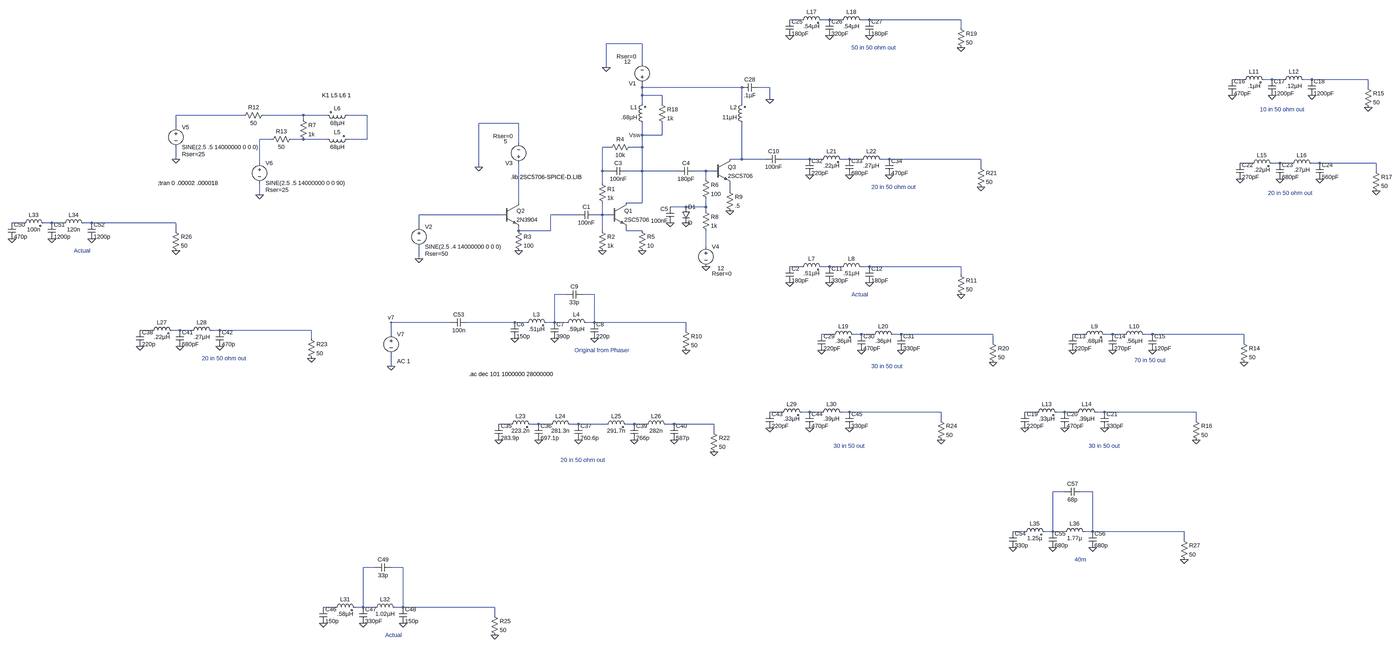
[diagram p0: schematic Phaser PA Impedance.asc, whole sheet]
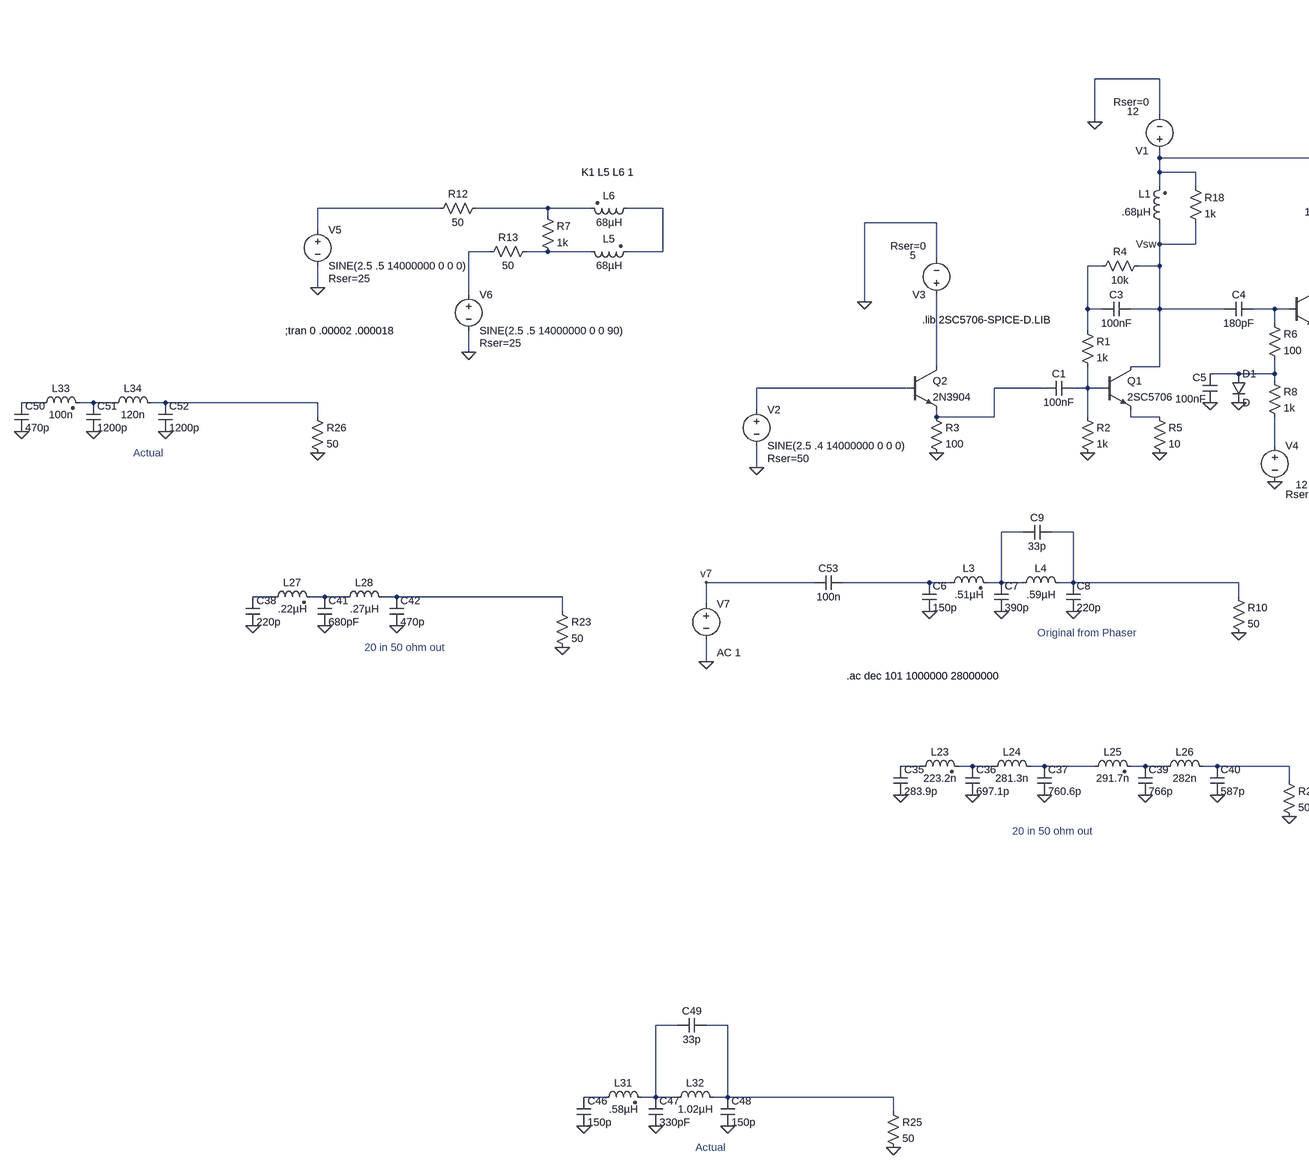
[diagram p1: schematic Phaser PA Impedance.asc, part, row 1 of 1, column 1 of 2]
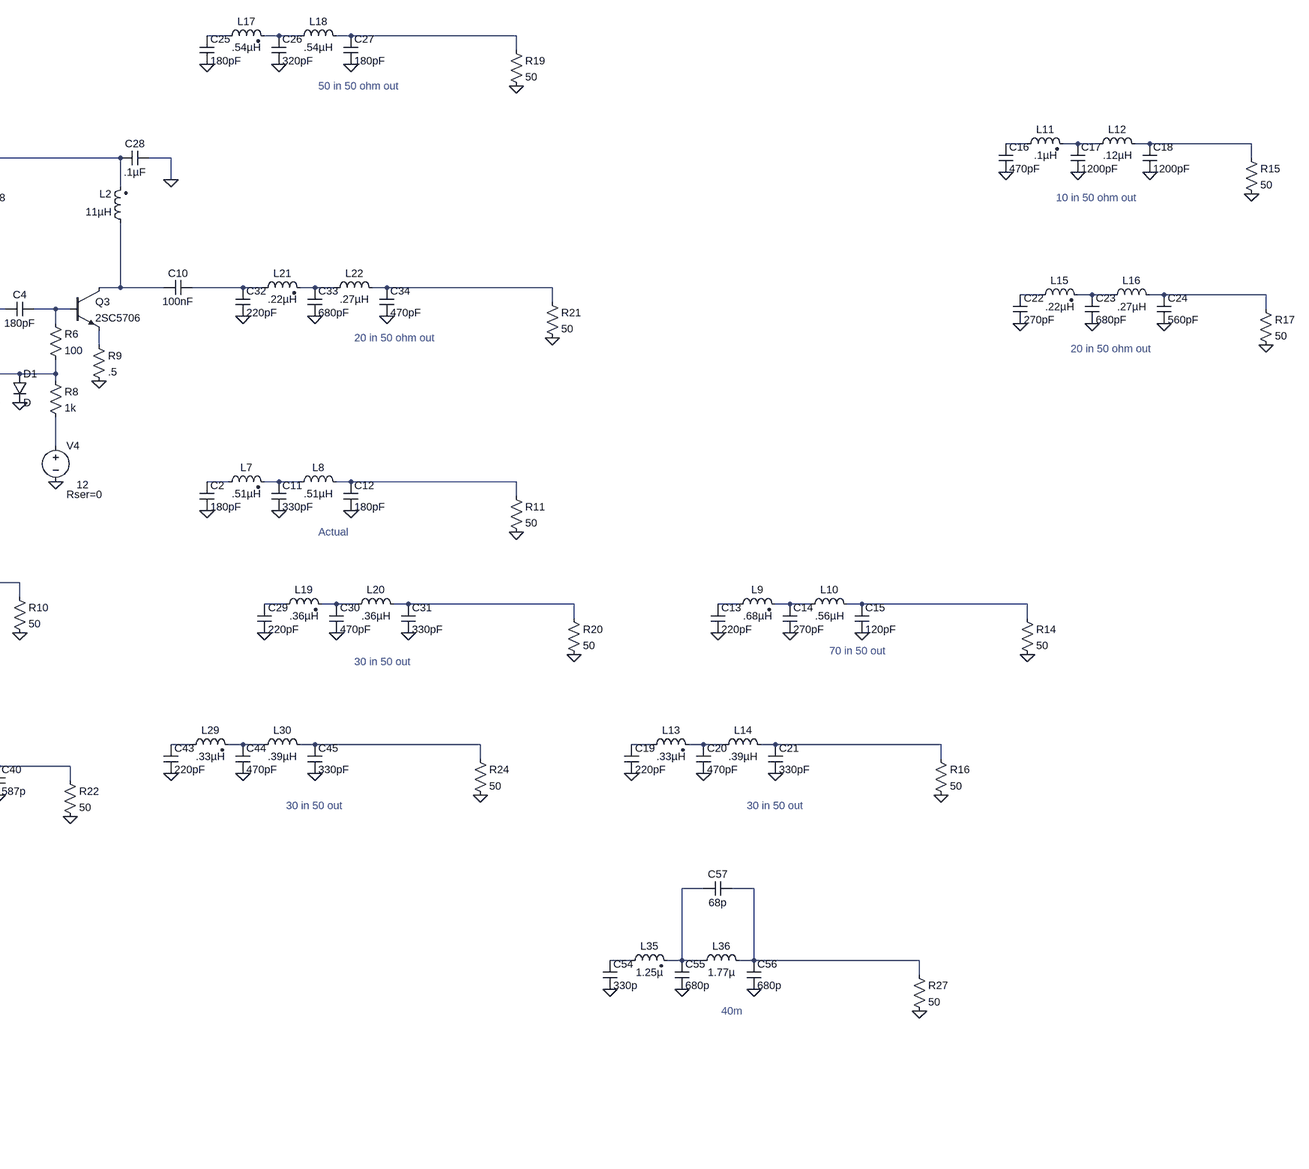
[diagram p2: schematic Phaser PA Impedance.asc, part, row 1 of 1, column 2 of 2]
Phaser PA Impedance.asc, the LTspice schematic file:
Version 4
SHEET 1 3764 2004
WIRE 1216 -560 1168 -560
WIRE 1328 -560 1296 -560
WIRE 1376 -560 1328 -560
WIRE 1488 -560 1456 -560
WIRE 1856 -560 1488 -560
WIRE 1856 -528 1856 -560
WIRE 576 -464 432 -464
WIRE 576 -384 576 -464
WIRE 432 -368 432 -464
WIRE 2992 -320 2944 -320
WIRE 3104 -320 3072 -320
WIRE 3152 -320 3104 -320
WIRE 3264 -320 3232 -320
WIRE 3632 -320 3264 -320
WIRE 576 -288 576 -304
WIRE 976 -288 576 -288
WIRE 1088 -288 1040 -288
WIRE 3632 -288 3632 -320
WIRE 576 -256 576 -288
WIRE 656 -256 576 -256
WIRE 1088 -240 1088 -288
WIRE 576 -224 576 -256
WIRE 656 -224 656 -256
WIRE 976 -224 976 -288
WIRE -1024 -176 -1296 -176
WIRE -784 -176 -944 -176
WIRE -688 -176 -784 -176
WIRE -528 -176 -608 -176
WIRE -784 -160 -784 -176
WIRE 80 -144 -80 -144
WIRE -1296 -128 -1296 -176
WIRE 576 -96 576 -144
WIRE 656 -96 656 -144
WIRE 656 -96 576 -96
WIRE -912 -80 -960 -80
WIRE -784 -80 -832 -80
WIRE -688 -80 -784 -80
WIRE -528 -80 -528 -176
WIRE -528 -80 -608 -80
WIRE 80 -64 80 -144
WIRE 448 -48 416 -48
WIRE 576 -48 576 -96
WIRE 576 -48 528 -48
WIRE -1296 0 -1296 -48
WIRE 976 0 976 -144
WIRE 976 0 928 0
WIRE 1072 0 976 0
WIRE 1248 0 1136 0
WIRE 1296 0 1248 0
WIRE 1408 0 1376 0
WIRE 1456 0 1408 0
WIRE 1568 0 1536 0
WIRE 1936 0 1568 0
WIRE -960 16 -960 -80
WIRE 3024 16 2976 16
WIRE 3136 16 3104 16
WIRE 3184 16 3136 16
WIRE 3296 16 3264 16
WIRE 3664 16 3296 16
WIRE -80 32 -80 -144
WIRE 1936 32 1936 0
WIRE 416 48 416 -48
WIRE 448 48 416 48
WIRE 576 48 576 -48
WIRE 576 48 512 48
WIRE 720 48 576 48
WIRE 832 48 784 48
WIRE 864 48 832 48
WIRE 3664 48 3664 16
WIRE 832 80 832 48
WIRE 416 96 416 48
WIRE 928 128 928 96
WIRE -960 144 -960 96
WIRE 80 176 80 16
WIRE 576 176 576 48
WIRE 576 176 512 176
WIRE 752 192 688 192
WIRE 832 192 832 160
WIRE 832 192 752 192
WIRE 832 208 832 192
WIRE 16 224 -320 224
WIRE 320 224 208 224
WIRE 416 224 416 176
WIRE 416 224 384 224
WIRE 448 224 416 224
WIRE -1936 256 -1984 256
WIRE -1824 256 -1856 256
WIRE -1776 256 -1824 256
WIRE -1664 256 -1696 256
WIRE -1296 256 -1664 256
WIRE -320 272 -320 224
WIRE -1296 288 -1296 256
WIRE 80 288 80 272
WIRE 208 288 208 224
WIRE 208 288 80 288
WIRE 416 288 416 224
WIRE 512 288 512 272
WIRE 576 288 512 288
WIRE 832 352 832 288
WIRE -320 400 -320 352
WIRE 1216 432 1168 432
WIRE 1328 432 1296 432
WIRE 1376 432 1328 432
WIRE 1488 432 1456 432
WIRE 1856 432 1488 432
WIRE 1856 464 1856 432
WIRE 272 544 224 544
WIRE 384 544 336 544
WIRE -192 656 -432 656
WIRE 64 656 -128 656
WIRE 112 656 64 656
WIRE 224 656 224 544
WIRE 224 656 192 656
WIRE 272 656 224 656
WIRE 384 656 384 544
WIRE 384 656 352 656
WIRE 752 656 384 656
WIRE -1392 688 -1440 688
WIRE -1280 688 -1312 688
WIRE -1232 688 -1280 688
WIRE -1120 688 -1152 688
WIRE -752 688 -1120 688
WIRE 752 688 752 656
WIRE -432 704 -432 656
WIRE 1344 704 1296 704
WIRE 1456 704 1424 704
WIRE 1504 704 1456 704
WIRE 1616 704 1584 704
WIRE 1984 704 1616 704
WIRE 2352 704 2304 704
WIRE 2464 704 2432 704
WIRE 2512 704 2464 704
WIRE 2624 704 2592 704
WIRE 2992 704 2624 704
WIRE -752 720 -752 688
WIRE 1984 736 1984 704
WIRE 2992 736 2992 704
WIRE -432 832 -432 784
WIRE 1136 1088 1088 1088
WIRE 1248 1088 1216 1088
WIRE 1296 1088 1248 1088
WIRE 1408 1088 1376 1088
WIRE 1776 1088 1408 1088
WIRE 2160 1088 2112 1088
WIRE 2272 1088 2240 1088
WIRE 2320 1088 2272 1088
WIRE 2432 1088 2400 1088
WIRE 2800 1088 2432 1088
WIRE 1776 1120 1776 1088
WIRE 2800 1120 2800 1088
WIRE 48 1136 0 1136
WIRE 160 1136 128 1136
WIRE 208 1136 160 1136
WIRE 320 1136 288 1136
WIRE 432 1136 320 1136
WIRE 544 1136 512 1136
WIRE 592 1136 544 1136
WIRE 704 1136 672 1136
WIRE 864 1136 704 1136
WIRE 864 1168 864 1136
WIRE 2272 1408 2224 1408
WIRE 2384 1408 2336 1408
WIRE 2112 1568 2064 1568
WIRE 2224 1568 2224 1408
WIRE 2224 1568 2192 1568
WIRE 2272 1568 2224 1568
WIRE 2384 1568 2384 1408
WIRE 2384 1568 2352 1568
WIRE 2752 1568 2384 1568
WIRE 2752 1600 2752 1568
WIRE -496 1712 -544 1712
WIRE -384 1712 -432 1712
WIRE -656 1872 -704 1872
WIRE -544 1872 -544 1712
WIRE -544 1872 -576 1872
WIRE -496 1872 -544 1872
WIRE -384 1872 -384 1712
WIRE -384 1872 -416 1872
WIRE -16 1872 -384 1872
WIRE -16 1904 -16 1872
FLAG 432 -368 0
FLAG 80 368 0
FLAG -80 32 0
FLAG 416 368 0
FLAG 576 368 0
FLAG 576 -96 Vsw
FLAG 688 256 0
FLAG 752 256 0
FLAG 928 208 0
FLAG 752 768 0
FLAG 64 720 0
FLAG 224 720 0
FLAG 384 720 0
FLAG 832 432 0
FLAG -1296 0 0
FLAG -960 144 0
FLAG 1856 544 0
FLAG 1168 496 0
FLAG 1328 496 0
FLAG 1488 496 0
FLAG 2992 816 0
FLAG 2304 768 0
FLAG 2464 768 0
FLAG 2624 768 0
FLAG 3632 -208 0
FLAG 2944 -256 0
FLAG 3104 -256 0
FLAG 3264 -256 0
FLAG 2800 1200 0
FLAG 2112 1152 0
FLAG 2272 1152 0
FLAG 2432 1152 0
FLAG 3664 128 0
FLAG 2976 80 0
FLAG 3136 80 0
FLAG 3296 80 0
FLAG 1856 -448 0
FLAG 1168 -496 0
FLAG 1328 -496 0
FLAG 1488 -496 0
FLAG -320 400 0
FLAG 1088 -240 0
FLAG 1984 816 0
FLAG 1296 768 0
FLAG 1456 768 0
FLAG 1616 768 0
FLAG 1936 112 0
FLAG 1248 64 0
FLAG 1408 64 0
FLAG 1568 64 0
FLAG 864 1248 0
FLAG 0 1200 0
FLAG 160 1200 0
FLAG 320 1200 0
FLAG -432 832 0
FLAG 544 1200 0
FLAG 704 1200 0
FLAG -752 800 0
FLAG -1440 752 0
FLAG -1280 752 0
FLAG -1120 752 0
FLAG -432 656 v7
FLAG 1776 1200 0
FLAG 1088 1152 0
FLAG 1248 1152 0
FLAG 1408 1152 0
FLAG -16 1984 0
FLAG -704 1936 0
FLAG -544 1936 0
FLAG -384 1936 0
FLAG -1296 368 0
FLAG -1984 320 0
FLAG -1824 320 0
FLAG -1664 320 0
FLAG 2752 1680 0
FLAG 2064 1632 0
FLAG 2224 1632 0
FLAG 2384 1632 0
SYMBOL npn 448 176 R0
SYMATTR InstName Q1
SYMATTR Value 2SC5706
SYMBOL voltage 576 -288 R180
WINDOW 123 0 0 Left 0
WINDOW 39 24 124 Left 2
WINDOW 3 46 103 Left 2
SYMATTR SpiceLine Rser=0
SYMATTR Value 12
SYMATTR InstName V1
SYMBOL npn 16 176 R0
SYMATTR InstName Q2
SYMATTR Value 2N3904
SYMBOL res 64 272 R0
SYMATTR InstName R3
SYMATTR Value 100
SYMBOL voltage 80 32 R180
WINDOW 123 0 0 Left 0
WINDOW 39 24 124 Left 2
WINDOW 3 46 103 Left 2
SYMATTR SpiceLine Rser=0
SYMATTR Value 5
SYMATTR InstName V3
SYMBOL cap 384 208 R90
WINDOW 0 0 32 VBottom 2
WINDOW 3 32 32 VTop 2
SYMATTR InstName C1
SYMATTR Value 100nF
SYMBOL res 400 80 R0
SYMATTR InstName R1
SYMATTR Value 1k
SYMBOL res 400 272 R0
SYMATTR InstName R2
SYMATTR Value 1k
SYMBOL res 544 -64 R90
WINDOW 0 0 56 VBottom 2
WINDOW 3 32 56 VTop 2
SYMATTR InstName R4
SYMATTR Value 10k
SYMBOL cap 512 32 R90
WINDOW 0 0 32 VBottom 2
WINDOW 3 32 32 VTop 2
SYMATTR InstName C3
SYMATTR Value 100nF
SYMBOL ind2 592 -128 R180
WINDOW 0 36 80 Left 2
WINDOW 3 36 40 Left 2
SYMATTR InstName L1
SYMATTR Value .68µH
SYMATTR Type ind
SYMBOL res 560 272 R0
SYMATTR InstName R5
SYMATTR Value 10
SYMBOL cap 784 32 R90
WINDOW 0 0 32 VBottom 2
WINDOW 3 32 32 VTop 2
SYMATTR InstName C4
SYMATTR Value 180pF
SYMBOL npn 864 0 R0
SYMATTR InstName Q3
SYMATTR Value 2SC5706
SYMBOL res 816 64 R0
SYMATTR InstName R6
SYMATTR Value 100
SYMBOL res 816 192 R0
SYMATTR InstName R8
SYMATTR Value 1k
SYMBOL diode 736 192 R0
SYMATTR InstName D1
SYMBOL cap 704 256 R180
WINDOW 0 24 56 Left 2
WINDOW 3 24 8 Left 2
SYMATTR InstName C5
SYMATTR Value 100nF
SYMBOL ind2 992 -128 R180
WINDOW 0 36 80 Left 2
WINDOW 3 36 40 Left 2
SYMATTR InstName L2
SYMATTR Value 11µH
SYMATTR Type ind
SYMBOL res 912 112 R0
SYMATTR InstName R9
SYMATTR Value .5
SYMBOL res 736 672 R0
SYMATTR InstName R10
SYMATTR Value 50
SYMBOL cap 48 656 R0
SYMATTR InstName C6
SYMATTR Value 150p
SYMBOL cap 208 656 R0
SYMATTR InstName C7
SYMATTR Value 390p
SYMBOL cap 368 656 R0
SYMATTR InstName C8
SYMATTR Value 220p
SYMBOL ind2 96 672 R270
WINDOW 0 32 56 VTop 2
WINDOW 3 5 56 VBottom 2
SYMATTR InstName L3
SYMATTR Value .51µH
SYMATTR Type ind
SYMBOL ind 256 672 R270
WINDOW 0 32 56 VTop 2
WINDOW 3 5 56 VBottom 2
SYMATTR InstName L4
SYMATTR Value .59µH
SYMBOL cap 336 528 R90
WINDOW 0 0 32 VBottom 2
WINDOW 3 32 32 VTop 2
SYMATTR InstName C9
SYMATTR Value 33p
SYMBOL cap 1136 -16 R90
WINDOW 0 0 32 VBottom 2
WINDOW 3 32 32 VTop 2
SYMATTR InstName C10
SYMATTR Value 100nF
SYMBOL voltage 832 336 R0
WINDOW 123 0 0 Left 0
WINDOW 39 24 124 Left 2
WINDOW 3 46 103 Left 2
SYMATTR SpiceLine Rser=0
SYMATTR Value 12
SYMATTR InstName V4
SYMBOL ind2 -704 -96 M90
WINDOW 0 4 56 VBottom 2
WINDOW 3 32 56 VTop 2
SYMATTR InstName L5
SYMATTR Value 68µH
SYMATTR Type ind
SYMBOL ind2 -592 -192 R90
WINDOW 0 4 56 VBottom 2
WINDOW 3 32 56 VTop 2
SYMATTR InstName L6
SYMATTR Value 68µH
SYMATTR Type ind
SYMBOL res -800 -176 R0
SYMATTR InstName R7
SYMATTR Value 1k
SYMBOL voltage -1296 -144 R0
WINDOW 123 0 0 Left 0
WINDOW 39 24 124 Left 2
SYMATTR SpiceLine Rser=25
SYMATTR InstName V5
SYMATTR Value SINE(2.5 .5 14000000 0 0 0)
SYMBOL voltage -960 0 R0
WINDOW 123 0 0 Left 0
WINDOW 39 24 124 Left 2
SYMATTR SpiceLine Rser=25
SYMATTR InstName V6
SYMATTR Value SINE(2.5 .5 14000000 0 0 90)
SYMBOL res -928 -192 R90
WINDOW 0 0 56 VBottom 2
WINDOW 3 32 56 VTop 2
SYMATTR InstName R12
SYMATTR Value 50
SYMBOL res -816 -96 R90
WINDOW 0 0 56 VBottom 2
WINDOW 3 32 56 VTop 2
SYMATTR InstName R13
SYMATTR Value 50
SYMBOL res 1840 448 R0
SYMATTR InstName R11
SYMATTR Value 50
SYMBOL cap 1152 432 R0
SYMATTR InstName C2
SYMATTR Value 180pF
SYMBOL cap 1312 432 R0
SYMATTR InstName C11
SYMATTR Value 330pF
SYMBOL cap 1472 432 R0
SYMATTR InstName C12
SYMATTR Value 180pF
SYMBOL ind2 1200 448 R270
WINDOW 0 32 56 VTop 2
WINDOW 3 5 56 VBottom 2
SYMATTR InstName L7
SYMATTR Value .51µH
SYMATTR Type ind
SYMBOL ind 1360 448 R270
WINDOW 0 32 56 VTop 2
WINDOW 3 5 56 VBottom 2
SYMATTR InstName L8
SYMATTR Value .51µH
SYMBOL res 2976 720 R0
SYMATTR InstName R14
SYMATTR Value 50
SYMBOL cap 2288 704 R0
SYMATTR InstName C13
SYMATTR Value 220pF
SYMBOL cap 2448 704 R0
SYMATTR InstName C14
SYMATTR Value 270pF
SYMBOL cap 2608 704 R0
SYMATTR InstName C15
SYMATTR Value 120pF
SYMBOL ind2 2336 720 R270
WINDOW 0 32 56 VTop 2
WINDOW 3 5 56 VBottom 2
SYMATTR InstName L9
SYMATTR Value .68µH
SYMATTR Type ind
SYMBOL ind 2496 720 R270
WINDOW 0 32 56 VTop 2
WINDOW 3 5 56 VBottom 2
SYMATTR InstName L10
SYMATTR Value .56µH
SYMBOL res 3616 -304 R0
SYMATTR InstName R15
SYMATTR Value 50
SYMBOL cap 2928 -320 R0
SYMATTR InstName C16
SYMATTR Value 470pF
SYMBOL cap 3088 -320 R0
SYMATTR InstName C17
SYMATTR Value 1200pF
SYMBOL cap 3248 -320 R0
SYMATTR InstName C18
SYMATTR Value 1200pF
SYMBOL ind2 2976 -304 R270
WINDOW 0 32 56 VTop 2
WINDOW 3 5 56 VBottom 2
SYMATTR InstName L11
SYMATTR Value .1µH
SYMATTR Type ind
SYMBOL ind 3136 -304 R270
WINDOW 0 32 56 VTop 2
WINDOW 3 5 56 VBottom 2
SYMATTR InstName L12
SYMATTR Value .12µH
SYMBOL res 2784 1104 R0
SYMATTR InstName R16
SYMATTR Value 50
SYMBOL cap 2096 1088 R0
SYMATTR InstName C19
SYMATTR Value 220pF
SYMBOL cap 2256 1088 R0
SYMATTR InstName C20
SYMATTR Value 470pF
SYMBOL cap 2416 1088 R0
SYMATTR InstName C21
SYMATTR Value 330pF
SYMBOL ind2 2144 1104 R270
WINDOW 0 32 56 VTop 2
WINDOW 3 5 56 VBottom 2
SYMATTR InstName L13
SYMATTR Value .33µH
SYMATTR Type ind
SYMBOL ind 2304 1104 R270
WINDOW 0 32 56 VTop 2
WINDOW 3 5 56 VBottom 2
SYMATTR InstName L14
SYMATTR Value .39µH
SYMBOL res 3648 32 R0
SYMATTR InstName R17
SYMATTR Value 50
SYMBOL cap 2960 16 R0
SYMATTR InstName C22
SYMATTR Value 270pF
SYMBOL cap 3120 16 R0
SYMATTR InstName C23
SYMATTR Value 680pF
SYMBOL cap 3280 16 R0
SYMATTR InstName C24
SYMATTR Value 560pF
SYMBOL ind2 3008 32 R270
WINDOW 0 32 56 VTop 2
WINDOW 3 5 56 VBottom 2
SYMATTR InstName L15
SYMATTR Value .22µH
SYMATTR Type ind
SYMBOL ind 3168 32 R270
WINDOW 0 32 56 VTop 2
WINDOW 3 5 56 VBottom 2
SYMATTR InstName L16
SYMATTR Value .27µH
SYMBOL res 640 -240 R0
SYMATTR InstName R18
SYMATTR Value 1k
SYMBOL res 1840 -544 R0
SYMATTR InstName R19
SYMATTR Value 50
SYMBOL cap 1152 -560 R0
SYMATTR InstName C25
SYMATTR Value 180pF
SYMBOL cap 1312 -560 R0
SYMATTR InstName C26
SYMATTR Value 320pF
SYMBOL cap 1472 -560 R0
SYMATTR InstName C27
SYMATTR Value 180pF
SYMBOL ind2 1200 -544 R270
WINDOW 0 32 56 VTop 2
WINDOW 3 5 56 VBottom 2
SYMATTR InstName L17
SYMATTR Value .54µH
SYMATTR Type ind
SYMBOL ind 1360 -544 R270
WINDOW 0 32 56 VTop 2
WINDOW 3 5 56 VBottom 2
SYMATTR InstName L18
SYMATTR Value .54µH
SYMBOL voltage -320 256 R0
WINDOW 123 0 0 Left 0
WINDOW 39 24 124 Left 2
SYMATTR SpiceLine Rser=50
SYMATTR InstName V2
SYMATTR Value SINE(2.5 .4 14000000 0 0 0)
SYMBOL cap 1040 -304 R90
WINDOW 0 0 32 VBottom 2
WINDOW 3 32 32 VTop 2
SYMATTR InstName C28
SYMATTR Value .1µF
SYMBOL res 1968 720 R0
SYMATTR InstName R20
SYMATTR Value 50
SYMBOL cap 1280 704 R0
SYMATTR InstName C29
SYMATTR Value 220pF
SYMBOL cap 1440 704 R0
SYMATTR InstName C30
SYMATTR Value 470pF
SYMBOL cap 1600 704 R0
SYMATTR InstName C31
SYMATTR Value 330pF
SYMBOL ind2 1328 720 R270
WINDOW 0 32 56 VTop 2
WINDOW 3 5 56 VBottom 2
SYMATTR InstName L19
SYMATTR Value .36µH
SYMATTR Type ind
SYMBOL ind 1488 720 R270
WINDOW 0 32 56 VTop 2
WINDOW 3 5 56 VBottom 2
SYMATTR InstName L20
SYMATTR Value .36µH
SYMBOL res 1920 16 R0
SYMATTR InstName R21
SYMATTR Value 50
SYMBOL cap 1232 0 R0
SYMATTR InstName C32
SYMATTR Value 220pF
SYMBOL cap 1392 0 R0
SYMATTR InstName C33
SYMATTR Value 680pF
SYMBOL cap 1552 0 R0
SYMATTR InstName C34
SYMATTR Value 470pF
SYMBOL ind2 1280 16 R270
WINDOW 0 32 56 VTop 2
WINDOW 3 5 56 VBottom 2
SYMATTR InstName L21
SYMATTR Value .22µH
SYMATTR Type ind
SYMBOL ind 1440 16 R270
WINDOW 0 32 56 VTop 2
WINDOW 3 5 56 VBottom 2
SYMATTR InstName L22
SYMATTR Value .27µH
SYMBOL res 848 1152 R0
SYMATTR InstName R22
SYMATTR Value 50
SYMBOL cap -16 1136 R0
SYMATTR InstName C35
SYMATTR Value 283.9p
SYMBOL cap 144 1136 R0
SYMATTR InstName C36
SYMATTR Value 697.1p
SYMBOL cap 304 1136 R0
SYMATTR InstName C37
SYMATTR Value 760.6p
SYMBOL ind2 32 1152 R270
WINDOW 0 32 56 VTop 2
WINDOW 3 5 56 VBottom 2
SYMATTR InstName L23
SYMATTR Value 223.2n
SYMATTR Type ind
SYMBOL ind 192 1152 R270
WINDOW 0 32 56 VTop 2
WINDOW 3 5 56 VBottom 2
SYMATTR InstName L24
SYMATTR Value 281.3n
SYMBOL voltage -432 688 R0
WINDOW 123 24 124 Left 2
WINDOW 39 24 152 Left 2
SYMATTR Value2 AC 1
SYMATTR InstName V7
SYMATTR Value ""
SYMBOL cap 528 1136 R0
SYMATTR InstName C39
SYMATTR Value 766p
SYMBOL cap 688 1136 R0
SYMATTR InstName C40
SYMATTR Value 587p
SYMBOL ind2 416 1152 R270
WINDOW 0 32 56 VTop 2
WINDOW 3 5 56 VBottom 2
SYMATTR InstName L25
SYMATTR Value 291.7n
SYMATTR Type ind
SYMBOL ind 576 1152 R270
WINDOW 0 32 56 VTop 2
WINDOW 3 5 56 VBottom 2
SYMATTR InstName L26
SYMATTR Value 282n
SYMBOL res -768 704 R0
SYMATTR InstName R23
SYMATTR Value 50
SYMBOL cap -1456 688 R0
SYMATTR InstName C38
SYMATTR Value 220p
SYMBOL cap -1296 688 R0
SYMATTR InstName C41
SYMATTR Value 680pF
SYMBOL cap -1136 688 R0
SYMATTR InstName C42
SYMATTR Value 470p
SYMBOL ind2 -1408 704 R270
WINDOW 0 32 56 VTop 2
WINDOW 3 5 56 VBottom 2
SYMATTR InstName L27
SYMATTR Value .22µH
SYMATTR Type ind
SYMBOL ind -1248 704 R270
WINDOW 0 32 56 VTop 2
WINDOW 3 5 56 VBottom 2
SYMATTR InstName L28
SYMATTR Value .27µH
SYMBOL res 1760 1104 R0
SYMATTR InstName R24
SYMATTR Value 50
SYMBOL cap 1072 1088 R0
SYMATTR InstName C43
SYMATTR Value 220pF
SYMBOL cap 1232 1088 R0
SYMATTR InstName C44
SYMATTR Value 470pF
SYMBOL cap 1392 1088 R0
SYMATTR InstName C45
SYMATTR Value 330pF
SYMBOL ind2 1120 1104 R270
WINDOW 0 32 56 VTop 2
WINDOW 3 5 56 VBottom 2
SYMATTR InstName L29
SYMATTR Value .33µH
SYMATTR Type ind
SYMBOL ind 1280 1104 R270
WINDOW 0 32 56 VTop 2
WINDOW 3 5 56 VBottom 2
SYMATTR InstName L30
SYMATTR Value .39µH
SYMBOL res -32 1888 R0
SYMATTR InstName R25
SYMATTR Value 50
SYMBOL cap -720 1872 R0
SYMATTR InstName C46
SYMATTR Value 150p
SYMBOL cap -560 1872 R0
SYMATTR InstName C47
SYMATTR Value 330pF
SYMBOL cap -400 1872 R0
SYMATTR InstName C48
SYMATTR Value 150p
SYMBOL ind2 -672 1888 R270
WINDOW 0 32 56 VTop 2
WINDOW 3 5 56 VBottom 2
SYMATTR InstName L31
SYMATTR Value .58µH
SYMATTR Type ind
SYMBOL ind -512 1888 R270
WINDOW 0 32 56 VTop 2
WINDOW 3 5 56 VBottom 2
SYMATTR InstName L32
SYMATTR Value 1.02µH
SYMBOL cap -432 1696 R90
WINDOW 0 0 32 VBottom 2
WINDOW 3 32 32 VTop 2
SYMATTR InstName C49
SYMATTR Value 33p
SYMBOL res -1312 272 R0
SYMATTR InstName R26
SYMATTR Value 50
SYMBOL cap -2000 256 R0
SYMATTR InstName C50
SYMATTR Value 470p
SYMBOL cap -1840 256 R0
SYMATTR InstName C51
SYMATTR Value 1200p
SYMBOL cap -1680 256 R0
SYMATTR InstName C52
SYMATTR Value 1200p
SYMBOL ind2 -1952 272 R270
WINDOW 0 32 56 VTop 2
WINDOW 3 5 56 VBottom 2
SYMATTR InstName L33
SYMATTR Value 100n
SYMATTR Type ind
SYMBOL ind -1792 272 R270
WINDOW 0 32 56 VTop 2
WINDOW 3 5 56 VBottom 2
SYMATTR InstName L34
SYMATTR Value 120n
SYMBOL cap -128 640 R90
WINDOW 0 0 32 VBottom 2
WINDOW 3 32 32 VTop 2
SYMATTR InstName C53
SYMATTR Value 100n
SYMBOL res 2736 1584 R0
SYMATTR InstName R27
SYMATTR Value 50
SYMBOL cap 2048 1568 R0
SYMATTR InstName C54
SYMATTR Value 330p
SYMBOL cap 2208 1568 R0
SYMATTR InstName C55
SYMATTR Value 680p
SYMBOL cap 2368 1568 R0
SYMATTR InstName C56
SYMATTR Value 680p
SYMBOL ind2 2096 1584 R270
WINDOW 0 32 56 VTop 2
WINDOW 3 5 56 VBottom 2
SYMATTR InstName L35
SYMATTR Value 1.25µ
SYMATTR Type ind
SYMBOL ind 2256 1584 R270
WINDOW 0 32 56 VTop 2
WINDOW 3 5 56 VBottom 2
SYMATTR InstName L36
SYMATTR Value 1.77µ
SYMBOL cap 2336 1392 R90
WINDOW 0 0 32 VBottom 2
WINDOW 3 32 32 VTop 2
SYMATTR InstName C57
SYMATTR Value 68p
TEXT -1368 96 Left 2 !;tran 0 .00002 .000018
TEXT 48 72 Left 2 !.lib 2SC5706-SPICE-D.LIB
TEXT -592 -256 Right 2 !K1 L5 L6 1
TEXT 304 768 Left 2 ;Original from Phaser
TEXT 1416 544 Left 2 ;Actual
TEXT 2552 808 Left 2 ;70 in 50 out
TEXT 2368 1224 Left 2 ;30 in 50 out
TEXT 3056 -200 Left 2 ;10 in 50 ohm out
TEXT 3088 136 Left 2 ;20 in 50 ohm out
TEXT 1416 -448 Left 2 ;50 in 50 ohm out
TEXT 1496 832 Left 2 ;30 in 50 out
TEXT 1496 112 Left 2 ;20 in 50 ohm out
TEXT 248 1280 Left 2 ;20 in 50 ohm out
TEXT -120 864 Left 2 !.ac dec 101 1000000 28000000
TEXT -1192 800 Left 2 ;20 in 50 ohm out
TEXT 1344 1224 Left 2 ;30 in 50 out
TEXT -456 1984 Left 2 ;Actual
TEXT -1736 368 Left 2 ;Actual
TEXT 2312 1680 Left 2 ;40m

The netlist it stands for:
* Phaser PA Impedance.asc
Q1 Vsw N027 N031 0 2SC5706
V1 N007 0 12 Rser=0
Q2 N023 N025 N026 0 2N3904
R3 N026 0 100
V3 N023 0 5 Rser=0
C1 N027 N026 100nF
R1 N013 N027 1k
R2 N027 0 1k
R4 Vsw N013 10k
C3 Vsw N013 100nF
L1 Vsw N007 .68µH
R5 N031 0 10
C4 N021 Vsw 180pF
Q3 N014 N021 N022 0 2SC5706
R6 N021 N024 100
R8 N024 N032 1k
D1 N024 0 D
C5 0 N024 100nF
L2 N014 N007 11µH
R9 N022 0 .5
R10 N037 0 50
C6 N038 0 150p
C7 N036 0 390p
C8 N037 0 220p
L3 N038 N036 .51µH
L4 N036 N037 .59µH
C9 N037 N036 33p
C10 N015 N014 100nF
V4 N032 0 12 Rser=0
L5 N012 N010 68µH
L6 N010 N009 68µH
R7 N009 N012 1k
V5 N008 0 SINE(2.5 .5 14000000 0 0 0) Rser=25
V6 N011 0 SINE(2.5 .5 14000000 0 0 90) Rser=25
R12 N009 N008 50
R13 N012 N011 50
R11 N035 0 50
C2 N033 0 180pF
C11 N034 0 330pF
C12 N035 0 180pF
L7 N033 N034 .51µH
L8 N034 N035 .51µH
R14 N047 0 50
C13 N045 0 220pF
C14 N046 0 270pF
C15 N047 0 120pF
L9 N045 N046 .68µH
L10 N046 N047 .56µH
R15 N006 0 50
C16 N004 0 470pF
C17 N005 0 1200pF
C18 N006 0 1200pF
L11 N004 N005 .1µH
L12 N005 N006 .12µH
R16 N053 0 50
C19 N051 0 220pF
C20 N052 0 470pF
C21 N053 0 330pF
L13 N051 N052 .33µH
L14 N052 N053 .39µH
R17 N020 0 50
C22 N018 0 270pF
C23 N019 0 680pF
C24 N020 0 560pF
L15 N018 N019 .22µH
L16 N019 N020 .27µH
R18 N007 Vsw 1k
R19 N003 0 50
C25 N001 0 180pF
C26 N002 0 320pF
C27 N003 0 180pF
L17 N001 N002 .54µH
L18 N002 N003 .54µH
V2 N025 0 SINE(2.5 .4 14000000 0 0 0) Rser=50
C28 0 N007 .1µF
R20 N044 0 50
C29 N042 0 220pF
C30 N043 0 470pF
C31 N044 0 330pF
L19 N042 N043 .36µH
L20 N043 N044 .36µH
R21 N017 0 50
C32 N015 0 220pF
C33 N016 0 680pF
C34 N017 0 470pF
L21 N015 N016 .22µH
L22 N016 N017 .27µH
R22 N058 0 50
C35 N054 0 283.9p
C36 N055 0 697.1p
C37 N056 0 760.6p
L23 N054 N055 223.2n
L24 N055 N056 281.3n
V7 v7 0 AC 1
C39 N057 0 766p
C40 N058 0 587p
L25 N056 N057 291.7n
L26 N057 N058 282n
R23 N041 0 50
C38 N039 0 220p
C41 N040 0 680pF
C42 N041 0 470p
L27 N039 N040 .22µH
L28 N040 N041 .27µH
R24 N050 0 50
C43 N048 0 220pF
C44 N049 0 470pF
C45 N050 0 330pF
L29 N048 N049 .33µH
L30 N049 N050 .39µH
R25 N063 0 50
C46 N064 0 150p
C47 N062 0 330pF
C48 N063 0 150p
L31 N064 N062 .58µH
L32 N062 N063 1.02µH
C49 N063 N062 33p
R26 N030 0 50
C50 N028 0 470p
C51 N029 0 1200p
C52 N030 0 1200p
L33 N028 N029 100n
L34 N029 N030 120n
C53 N038 v7 100n
R27 N060 0 50
C54 N061 0 330p
C55 N059 0 680p
C56 N060 0 680p
L35 N061 N059 1.25µ
L36 N059 N060 1.77µ
C57 N060 N059 68p
.model D D
.lib standard.dio
.model NPN NPN
.model PNP PNP
.lib standard.bjt
;tran 0 .00002 .000018
.lib 2SC5706-SPICE-D.LIB
K1 L5 L6 1
* Original from Phaser
* Actual
* 70 in 50 out
* 30 in 50 out
* 10 in 50 ohm out
* 20 in 50 ohm out
* 50 in 50 ohm out
* 30 in 50 out
* 20 in 50 ohm out
* 20 in 50 ohm out
.ac dec 101 1000000 28000000
* 20 in 50 ohm out
* 30 in 50 out
* Actual
* Actual
* 40m
.backanno
.end